# Altium project Motor_Driver.PrjPcb
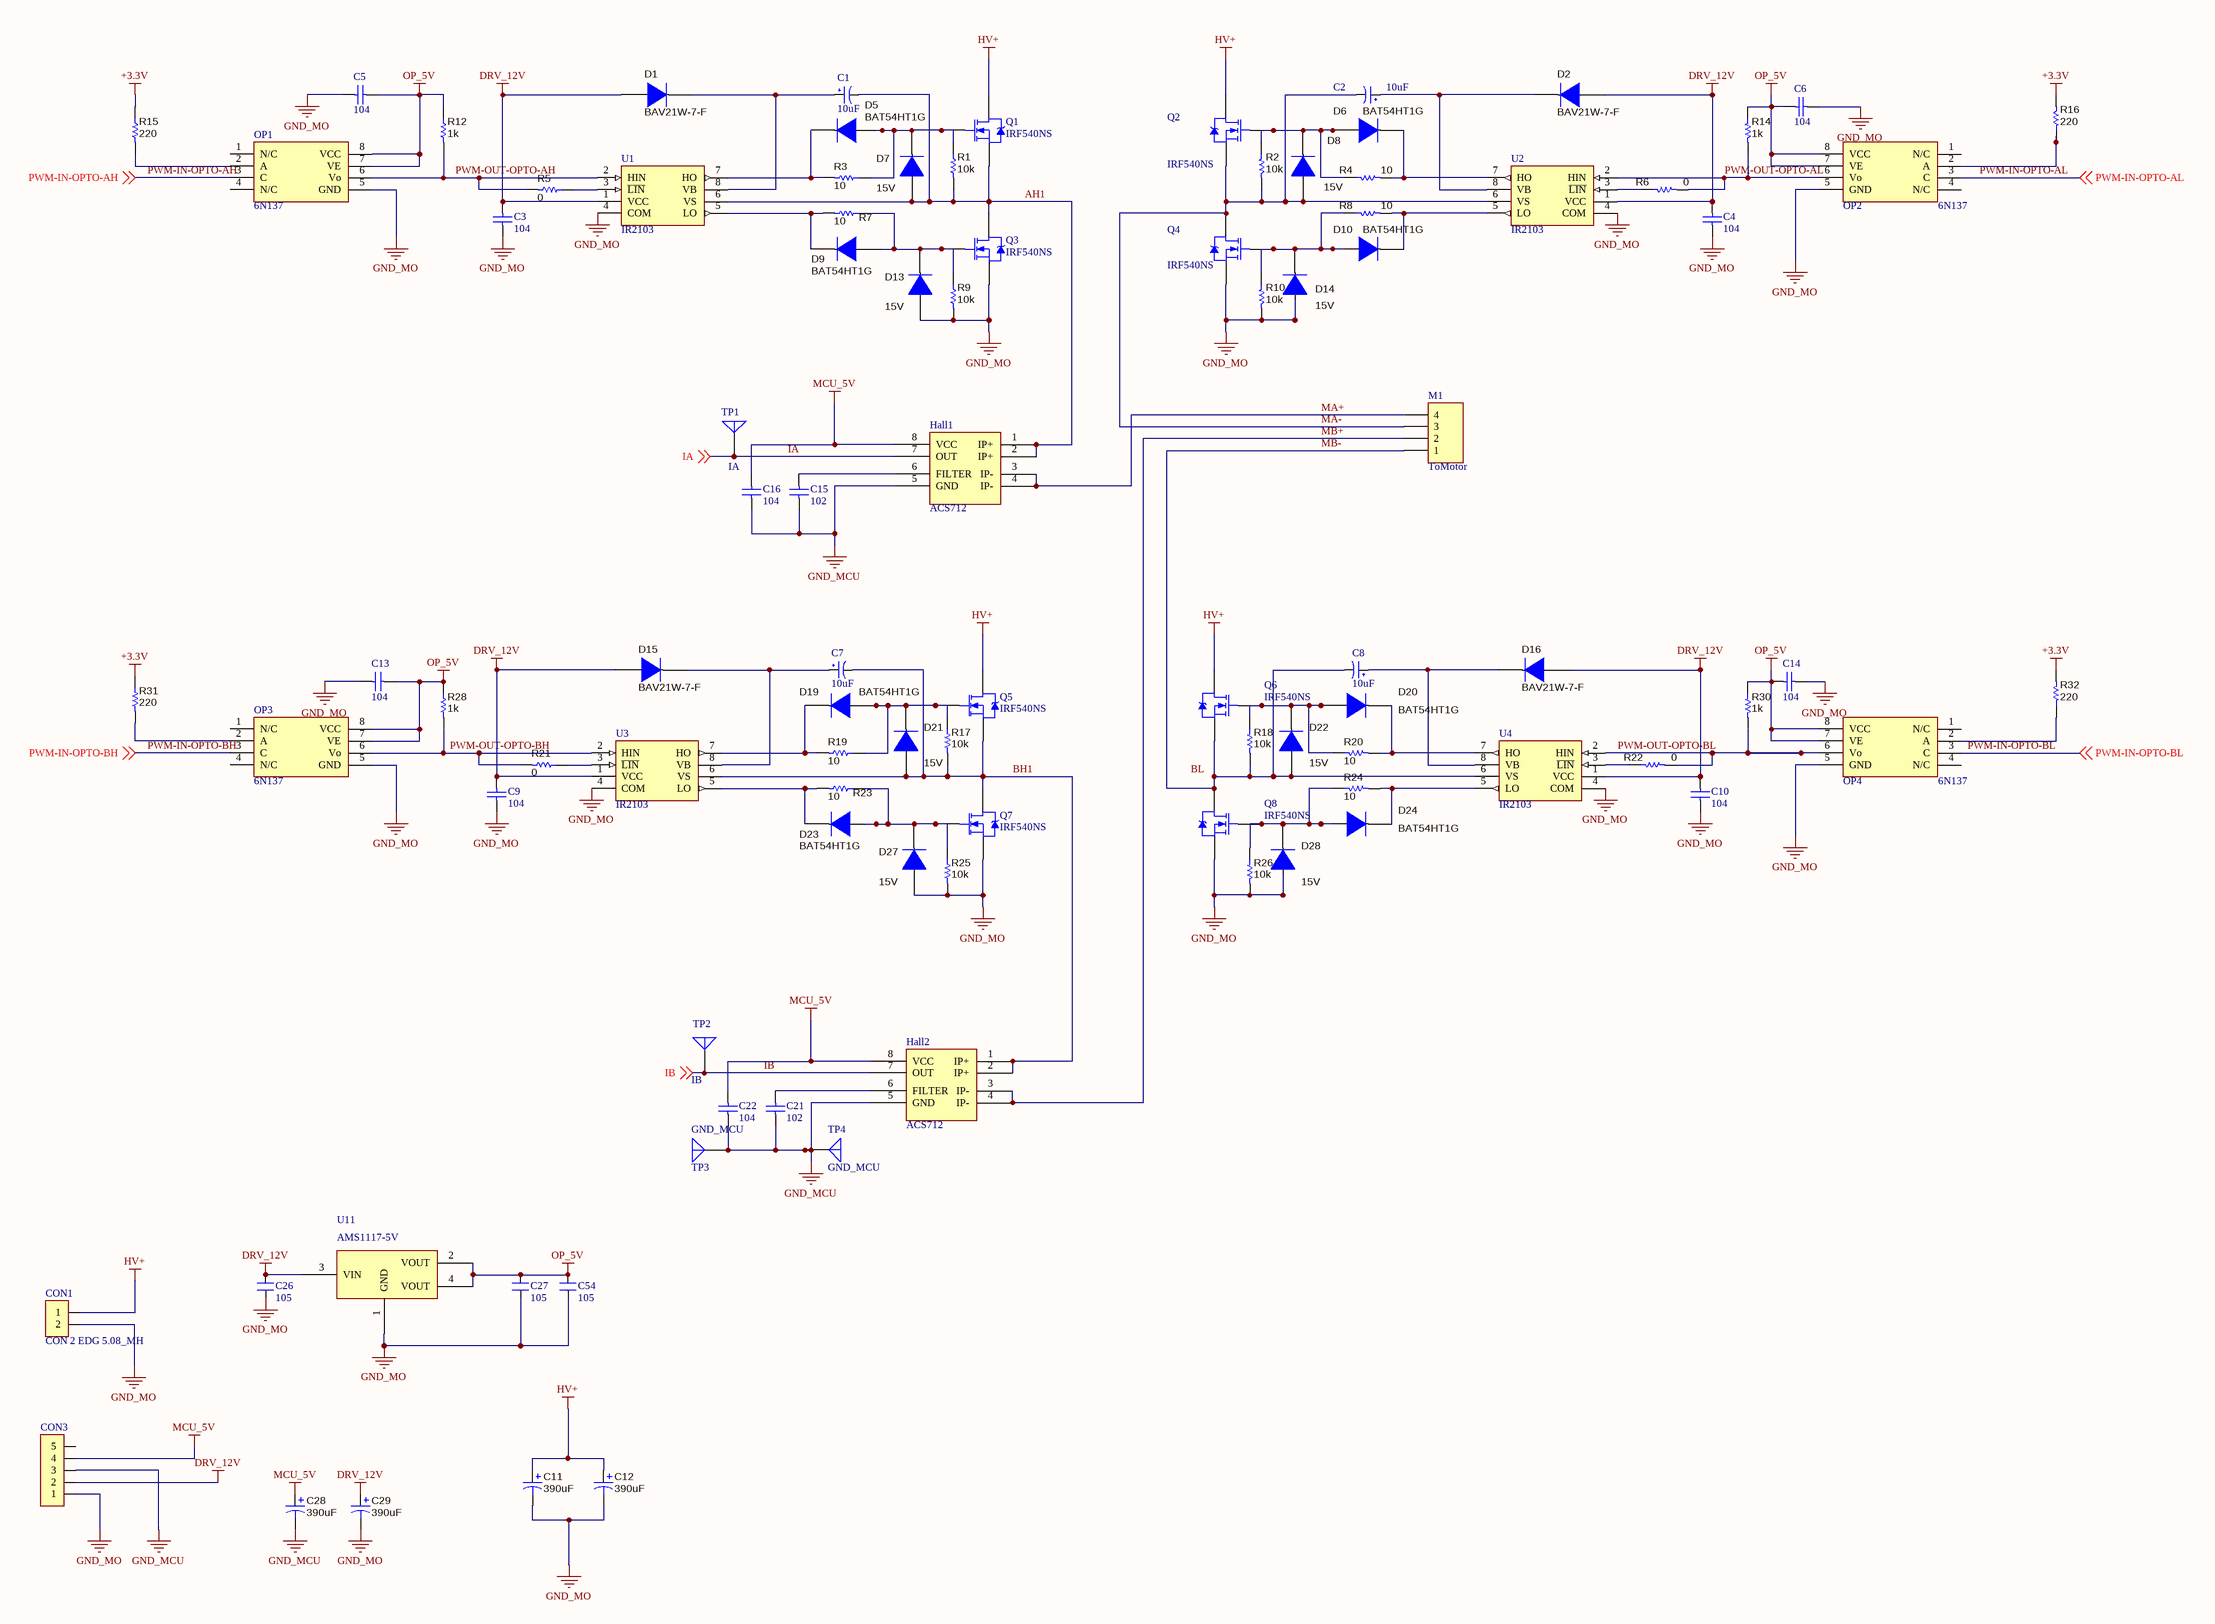
[diagram p0: H_bridge.SchDoc]
2 sheets, 122 parts. Net scope: global (net labels, ports and power ports of the same name join across sheets).
Board file: PCB.PcbDoc
Sheets:
  H_bridge.SchDoc
  MCU.SchDoc

## Sheet H_bridge.SchDoc
size C

### Parts
C1  10uF  [TU_NHOM_10uF_MH]
C2  10uF  [TU_NHOM_10uF_MH]
C3  104  [TU_SMD_0805]
C4  104  [TU_SMD_0805]
C5  104  [TU_SMD_0805]
C6  104  [TU_SMD_0805]
C7  10uF  [TU_NHOM_10uF_MH]
C8  10uF  [TU_NHOM_10uF_MH]
C9  104  [TU_SMD_0805]
C10  104  [TU_SMD_0805]
C11  390uF  [CAP_12.5 X 25]
C12  390uF  [CAP_12.5 X 25]
C13  104  [TU_SMD_0805]
C14  104  [TU_SMD_0805]
C15  102  [TU_SMD_0805]
C16  104  [TU_SMD_0805]
C21  102  [TU_SMD_0805]
C22  104  [TU_SMD_0805]
C26  105  [0805_HV]
C27  105  [0805_HV]
C28  390uF  [CP1/3.0]
C29  390uF  [CP1/3.0]
C54  105  [0805_HV]
CON1  CON 2 EDG 5.08_MH  [CON 2 EDG 5.08]
CON3  CON 5 EDG 5.08_MH  [Con 5 EDG 5.08]  (value not drawn)
D1  BAV21W-7-F  [SOD-323]
D2  BAV21W-7-F  [SOD-323]
D5  BAT54HT1G  [SOD-323]
D6  BAT54HT1G  [SOD-323]
D7  15V  [SOD-323]
D8  15V  [SOD-323]
D9  BAT54HT1G  [SOD-323]
D10  BAT54HT1G  [SOD-323]
D13  15V  [SOD-323]
D14  15V  [SOD-323]
D15  BAV21W-7-F  [SOD-323]
D16  BAV21W-7-F  [SOD-323]
D19  BAT54HT1G  [SOD-323]
D20  BAT54HT1G  [SOD-323]
D21  15V  [SOD-323]
D22  15V  [SOD-323]
D23  BAT54HT1G  [SOD-323]
D24  BAT54HT1G  [SOD-323]
D27  15V  [SOD-323]
D28  15V  [SOD-323]
Hall1  ACS712  [SOP 8]
Hall2  ACS712  [SOP 8]
M1  ToMotor  [Con 4 EDG 5.08]
OP1  6N137 DIP8 Opto 10Mbit  [SMD-8_6.3MM]  (value not drawn)
OP2  6N137 DIP8 Opto 10Mbit  [SMD-8_6.3MM]  (value not drawn)
OP3  6N137 DIP8 Opto 10Mbit  [SMD-8_6.3MM]  (value not drawn)
OP4  6N137 DIP8 Opto 10Mbit  [SMD-8_6.3MM]  (value not drawn)
Q1  IRF540NS  [D2PAK_M_1]
Q2  IRF540NS  [D2PAK_M_1]
Q3  IRF540NS  [D2PAK_M_1]
Q4  IRF540NS  [D2PAK_M_1]
Q5  IRF540NS  [D2PAK_M_1]
Q6  IRF540NS  [D2PAK_M_1]
Q7  IRF540NS  [D2PAK_M_1]
Q8  IRF540NS  [D2PAK_M_1]
R1  10k  [Tro SMD 0805]
R2  10k  [Tro SMD 0805]
R3  10  [Tro SMD 0805]
R4  10  [Tro SMD 0805]
R5  0  [Tro SMD 0805]
R6  0  [Tro SMD 0805]
R7  10  [Tro SMD 0805]
R8  10  [Tro SMD 0805]
R9  10k  [Tro SMD 0805]
R10  10k  [Tro SMD 0805]
R12  1k  [Tro SMD 0805]
R14  1k  [Tro SMD 0805]
R15  220  [Tro SMD 0805]
R16  220  [Tro SMD 0805]
R17  10k  [Tro SMD 0805]
R18  10k  [Tro SMD 0805]
R19  10  [Tro SMD 0805]
R20  10  [Tro SMD 0805]
R21  0  [Tro SMD 0805]
R22  0  [Tro SMD 0805]
R23  10  [Tro SMD 0805]
R24  10  [Tro SMD 0805]
R25  10k  [Tro SMD 0805]
R26  10k  [Tro SMD 0805]
R28  1k  [Tro SMD 0805]
R30  1k  [Tro SMD 0805]
R31  220  [Tro SMD 0805]
R32  220  [Tro SMD 0805]
TP1  IA  [PIN1]
TP2  IB  [PIN1]
TP3  GND_MCU  [PIN1]
TP4  GND_MCU  [PIN1]
U1  IR2103  [SOP 8]
U2  IR2103  [SOP 8]
U3  IR2103  [SOP 8]
U4  IR2103  [SOP 8]
U11  AMS1117-5V  [SOT223]

### Nets
+3.3V: R15.1 R16.2 R31.1 R32.2
DRV_12V: C3.2 C4.2 C9.2 C10.2 C26.2 C29.1(+) CON3.2 D1.2(A) D2.2(A) D15.2(A) D16.2(A) U1.1(VCC) U2.1(VCC) U3.1(VCC) U4.1(VCC) U11.3(VIN)
GND_MCU: C15.1 C16.1 C21.1 C22.1 C28.2(-) CON3.3 Hall1.5(GND) Hall2.5(GND) TP3.1(A) TP4.1(A)
GND_MO: C3.1 C4.1 C5.2 C6.2 C9.1 C10.1 C11.2(-) C12.2(-) C13.2 C14.2 C26.1 C27.1 C29.2(-) C54.1 CON1.2 CON3.1 D13.2(A) D14.2(A) D27.2(A) D28.2(A) OP1.5(GND) OP2.5(GND) OP3.5(GND) OP4.5(GND) Q3.3(S) Q4.3(S) Q7.3(S) Q8.3(S) R9.2 R10.2 R25.2 R26.2 U1.4(COM) U2.4(COM) U3.4(COM) U4.4(COM) U11.1(GND)
HV+: C11.1(+) C12.1(+) CON1.1 Q1.2(D) Q2.2(D) Q5.2(D) Q6.2(D)
MCU_5V: C16.2 C22.2 C28.1(+) CON3.4 Hall1.8(VCC) Hall2.8(VCC)
OP_5V: C5.1 C6.1 C13.1 C14.1 C27.2 C54.2 OP1.7(VE) OP1.8(VCC) OP2.7(VE) OP2.8(VCC) OP3.7(VE) OP3.8(VCC) OP4.7(VE) OP4.8(VCC) R12.1 R14.1 R28.1 R30.1 U11.2(VOUT) U11.4(VOUT)
AH1: C1.2 D7.2(A) Hall1.1(IP+) Hall1.2(IP+) Q1.3(S) Q3.2(D) R1.2 U1.6(VS)
BH1: C7.2 D21.2(A) Hall2.1(IP+) Hall2.2(IP+) Q5.3(S) Q7.2(D) R17.2 U3.6(VS)
IA: Hall1.7(OUT) TP1.1(A) ; off-sheet IA
IB: Hall2.7(OUT) TP2.1(A) ; off-sheet IB
MA+: Hall1.3(IP-) Hall1.4(IP-) M1.4
MA-: C2.2 D8.2(A) M1.3 Q2.3(S) Q4.2(D) R2.2 U2.6(VS)
MB+: Hall2.3(IP-) Hall2.4(IP-) M1.2
MB-: C8.2 D22.2(A) M1.1 Q6.3(S) Q8.2(D) R18.2 U4.6(VS)
PWM-IN-OPTO-AH: OP1.3(C) ; off-sheet PWM-IN-OPTO-AH
PWM-IN-OPTO-AL: OP2.3(C) ; off-sheet PWM-IN-OPTO-AL
PWM-IN-OPTO-BH: OP3.3(C) ; off-sheet PWM-IN-OPTO-BH
PWM-IN-OPTO-BL: OP4.3(C) ; off-sheet PWM-IN-OPTO-BL
PWM-OUT-OPTO-AH: OP1.6(Vo) R5.2 R12.2 U1.2(HIN)
PWM-OUT-OPTO-AL: OP2.6(Vo) R6.2 R14.2 U2.2(HIN)
PWM-OUT-OPTO-BH: OP3.6(Vo) R21.2 R28.2 U3.2(HIN)
PWM-OUT-OPTO-BL: OP4.6(Vo) R22.2 R30.2 U4.2(HIN)
NetC1_1: C1.1 D1.1(K) U1.8(VB)
NetC2_1: C2.1 D2.1(K) U2.8(VB)
NetC7_1: C7.1 D15.1(K) U3.8(VB)
NetC8_1: C8.1 D16.1(K) U4.8(VB)
NetC15_2: C15.2 Hall1.6(FILTER)
NetC21_2: C21.2 Hall2.6(FILTER)
NetD5_1: D5.1(K) R3.2 U1.7(HO)
NetD5_2: D5.2(A) D7.1(K) Q1.1(G) R1.1 R3.1
NetD6_1: D6.1(K) R4.2 U2.7(HO)
NetD6_2: D6.2(A) D8.1(K) Q2.1(G) R2.1 R4.1
NetD9_1: D9.1(K) R7.2 U1.5(LO)
NetD9_2: D9.2(A) D13.1(K) Q3.1(G) R7.1 R9.1
NetD10_1: D10.1(K) R8.2 U2.5(LO)
NetD10_2: D10.2(A) D14.1(K) Q4.1(G) R8.1 R10.1
NetD19_1: D19.1(K) R19.2 U3.7(HO)
NetD19_2: D19.2(A) D21.1(K) Q5.1(G) R17.1 R19.1
NetD20_1: D20.1(K) R20.2 U4.7(HO)
NetD20_2: D20.2(A) D22.1(K) Q6.1(G) R18.1 R20.1
NetD23_1: D23.1(K) R23.2 U3.5(LO)
NetD23_2: D23.2(A) D27.1(K) Q7.1(G) R23.1 R25.1
NetD24_1: D24.1(K) R24.2 U4.5(LO)
NetD24_2: D24.2(A) D28.1(K) Q8.1(G) R24.1 R26.1
NetOP1_2: OP1.2(A) R15.2
NetOP2_2: OP2.2(A) R16.1
NetOP3_2: OP3.2(A) R31.2
NetOP4_2: OP4.2(A) R32.1
NetR5_1: R5.1 U1.3(~{LIN})
NetR6_1: R6.1 U2.3(~{LIN})
NetR21_1: R21.1 U3.3(~{LIN})
NetR22_1: R22.1 U4.3(~{LIN})

Not connected (* = marked no-connect by the designer): CON3 5; OP1 1(N/C) 4(N/C); OP2 1(N/C) 4(N/C); OP3 1(N/C) 4(N/C); OP4 1(N/C) 4(N/C)

### Notes on the sheet
- Labels drawn without touching a wire or pin: BL

### Library data of the parts
C1 C2 C7 C8 = TU_NHOM_10uF_25V_MH: Value: 47uF/16 - 50V; Description 1: 470uF/6,3V - 330uF/10V - 220uF/16V; Description 2: 100uF/25V - 35V - 47uF/50V - 22uF/100V; Description 3: 33uF => 47uF/63V - 1uF => 4,7uF/160V; Description 4: 1uF => 2,2uF/250V - 1uF/350V
C3-C6 C9 C10 C13-C16 C21 C22 = Capacitor 0805: Ceramic Chip Capacitor - Standard; Note: Footprint corresponds to dimensions for bulk cassette packaging. This case size has tightened tolerances.; Published: 17-Jul-2002; LatestRevisionDate: 19-Mar-2004; LatestRevisionNote: Silkscreen size reduced.; DatasheetDocument: Mar-2001; PackageDocument: Mar-2001; PackageReference: 0805; Publisher: Altium Limited; Code_JEITA: 0805; Code_IPC: 2012[0805]; ComponentLink1Description: Manufacturer Link; ComponentLink1URL: http://www.kemet.com/; ComponentLink2Description: Datasheet; ComponentLink2URL: http://www.kemet.com/kemet/web/homepage/kechome.nsf/vapubfilesname/F3102TA.pdf/$file/F3102TA.pdf
  C3-C6 C9 C10 C13 C14 C16 C22: Value: 104
  C15 C21: Value: 102
C11 C12 = Capacitor TuHoa: CAP ALUM 390UF 20% 50V RADIAL; PartNumber: UHW1H391MPD6; Manufacturer: Nichicon; Polarized: Y; U/M: EA; Cap_F: 0.000390; Tolerance_%: 20; Value1: Unknown; VDC_V: 50; TaMin_C: -40; TaMax_C: 105; Cap_Case: 10x22; AEC Category: Q200; AEC Qualified: N; CompType: Capacitor; SymbolVersion: 2008-07-09; Value: 390uF; PackageReference: 10x22; RoHS: Y; Value2: 50V; MountType: TH; Technology: AL; Series: ZL; Publisher: Texas Instruments; LatestRevisionDate: 2015-12-17; ComponentLink1Description: Datasheet link; ComponentLink1URL: http://nichicon-us.com/english/products/pdfs/e-uhw.pdf; Supplier 1: Digi-Key; Supplier Part Number 1: 493-6885-ND; AEC Grade: N/A; ValueDisplayed: 390uF
C26 C27 C54 = CM: Cap SMD; Value: 103
C28 C29 = Capacitor TuHoa: PartNumber: UHW1H391MPD6; Manufacturer: Nichicon; Polarized: Y; U/M: EA; Cap_F: 0.000390; Tolerance_%: 20; Value1: Unknown; VDC_V: 50; Value2: 50V; TaMin_C: -40; TaMax_C: 105; Cap_Case: 10x22; AEC Category: Q200; AEC Qualified: N; CompType: Capacitor; SymbolVersion: 2008-07-09; Value: 390uF; PackageReference: 10x22; RoHS: Y; MountType: TH; Technology: AL; Series: ZL; Publisher: Texas Instruments; LatestRevisionDate: 2015-12-17; ComponentLink1Description: Datasheet link; ComponentLink1URL: http://nichicon-us.com/english/products/pdfs/e-uhw.pdf; Supplier 1: Digi-Key; Supplier Part Number 1: 493-6885-ND; AEC Grade: N/A; ValueDisplayed: 390uF
CON1 = CON 2 EDG 5.08_MH: CON 2 EDG 5.08 (xanh cong)
CON3 = CON 5 EDG 5.08_MH: CON 5 EDG 5.08 (xanh cong)
D1 D2 D5 D6 D9 D10 D15 D16 D19 D20 D23 D24 = MMDL914-TP: Diode, Switching, 100 V, 0.2 A, SOD-323; Manufacturer: Micro Commercial Components; U/M: EA; Vf_V: 1; Value: 100V; Value1: 0.2A; Value2: 1V; Io_A: 0.2; Vr_V: 100; TJmax_C: 150; SizeAreaWB_mm2: 8.695; SizeArea_mm2: 3.645; SizeX_mm: 2.7; SizeY_mm: 1.35; AEC Category: Q101; SymbolVersion: 2008-12-08; PackageReference: SOD-323; CompType: Diode; MountType: SMT; Type: Switching; RoHS: Y; SizeZ_mm: 1; Published: 2008-06-26; Publisher: Texas Instruments; LatestRevisionDate: 2016-10-18; ComponentLink1Description: Datasheet link; ComponentLink1URL: http://www.mccsemi.com/up_pdf/MMDL914(SOD-323).pdf; Supplier 1: Digi-Key; Supplier Part Number 1: MMDL914-TPMSCT-ND; AEC Qualified: ?
  D1 D2 D15 D16: PartNumber: BAV21W-7-F
  D5 D6 D9 D10 D19 D20 D23 D24: PartNumber: BAT54HT1G
D7 D8 D13 D14 D21 D22 D27 D28 = MMDL914-TP: Diode, Switching, 100 V, 0.2 A, SOD-323; PartNumber: BAV21W-7-F; Manufacturer: Micro Commercial Components; U/M: EA; Vf_V: 1; Value: 100V; Value1: 0.2A; Value2: 1V; Io_A: 0.2; Vr_V: 100; TJmax_C: 150; SizeAreaWB_mm2: 8.695; SizeArea_mm2: 3.645; SizeX_mm: 2.7; SizeY_mm: 1.35; AEC Category: Q101; SymbolVersion: 2008-12-08; PackageReference: SOD-323; CompType: Diode; MountType: SMT; Type: Switching; RoHS: Y; SizeZ_mm: 1; Published: 2008-06-26; Publisher: Texas Instruments; LatestRevisionDate: 2016-10-18; ComponentLink1Description: Datasheet link; ComponentLink1URL: http://www.mccsemi.com/up_pdf/MMDL914(SOD-323).pdf; Supplier 1: Digi-Key; Supplier Part Number 1: MMDL914-TPMSCT-ND; AEC Qualified: ?
M1 = Header 4: Header, 4-Pin; LatestRevisionDate: 17-Jul-2002; LatestRevisionNote: Re-released for DXP Platform.; Publisher: Altium Limited
OP1-OP4 = 6N137: 6N137 DIP8 Opto 10Mbit/s
Q1-Q8 = IRF540NS: HEXFET Power MOSFET; Published: 8-Jun-2000; LatestRevisionDate: 20-Nov-2009; LatestRevisionNote: IPC-7351 Footprint Added.; DatasheetVersion: May-1998; PackageReference: D2PAK; Publisher: Altium Limited; PackageDescription: 3-Pin Transistor Outline Package 2.54 mm Pitch, 15.1 mm Lead Span; ComponentLink1Description: Manufacturer Link; ComponentLink1URL: http://www.irf.com/; ComponentLink2Description: Datasheet; ComponentLink2URL: http://www.irf.com/product-info/datasheets/data/irf540ns.pdf; Supplier 1: Farnell
R1-R10 R12 R14-R26 R28 R30-R32 = R nho: RES, 100, 1%, 0.1 W, 0402; PartNumber: ERJ-2RKF1000X; Manufacturer: Panasonic; CompType: Resistor; Res_ohm: 100; Value_Code: 100R; Tolerance_%: 1; Power_W: 0.1; Value2: 0.1W; VDC_V: 50; TempCo: 100 ppm/C; EIA_Code: E96; U/M: EA; AEC Category: Q200; SymbolVersion: 2009-05-29; PackageReference: 0402; RoHS: Y; Value1: 1%; MountType: SMT; Technology: Thick Film; Published: 2008-06-26; Publisher: Texas Instruments; LatestRevisionDate: 2016-01-08; ComponentLink1Description: Datasheet link; ComponentLink1URL: http://industrial.panasonic.com/www-data/pdf/AOA0000/AOA0000CE2.pdf; Supplier 1: Digi-Key; Supplier Part Number 1: P100LCT-ND; Supplier 2: Mouser; Supplier Part Number 2: 667-ERJ-2RKF1000X; Supplier 3: Farnell; Supplier Part Number 3: 2304034; AEC Qualified: ?
  R1 R2 R9 R10 R17 R18 R25 R26: Value: 10k
  R3 R4 R7 R8 R19 R20 R23 R24: Value: 10
  R5 R6 R21 R22: Value: 0
  R12 R14 R28 R30: Value: 1k
  R15 R16 R31 R32: Value: 220
TP1-TP4 = Antenna: Generic Antenna; Published: 24-Mar-1999; LatestRevisionDate: 17-Jul-2002; LatestRevisionNote: Re-released for DXP Platform.; PackageReference: PIN1; Publisher: Altium Limited
U1-U4 = IR2103: High and Low Side Driver; Published: 8-Jun-2000; LatestRevisionDate: 04-Mar-2005; LatestRevisionNote: Stylized 3D Model Added.; DatasheetVersion: PD600451; PackageReference: PDIP8; Publisher: Altium Limited; PackageDescription: DIP; 8 Leads; Row Spacing 7.62 mm; Pitch 2.54 mm; Code_JEDEC: MO-001-AN; ComponentLink1Description: Manufacturer Link; ComponentLink1URL: http://www.irf.com/; ComponentLink2Description: Datasheet; ComponentLink2URL: http://www.irf.com/product-info/datasheets/data/ir2103.pdf
U11 = AMS1117-3.3V SOT223 _MH

## Sheet MCU.SchDoc
size B
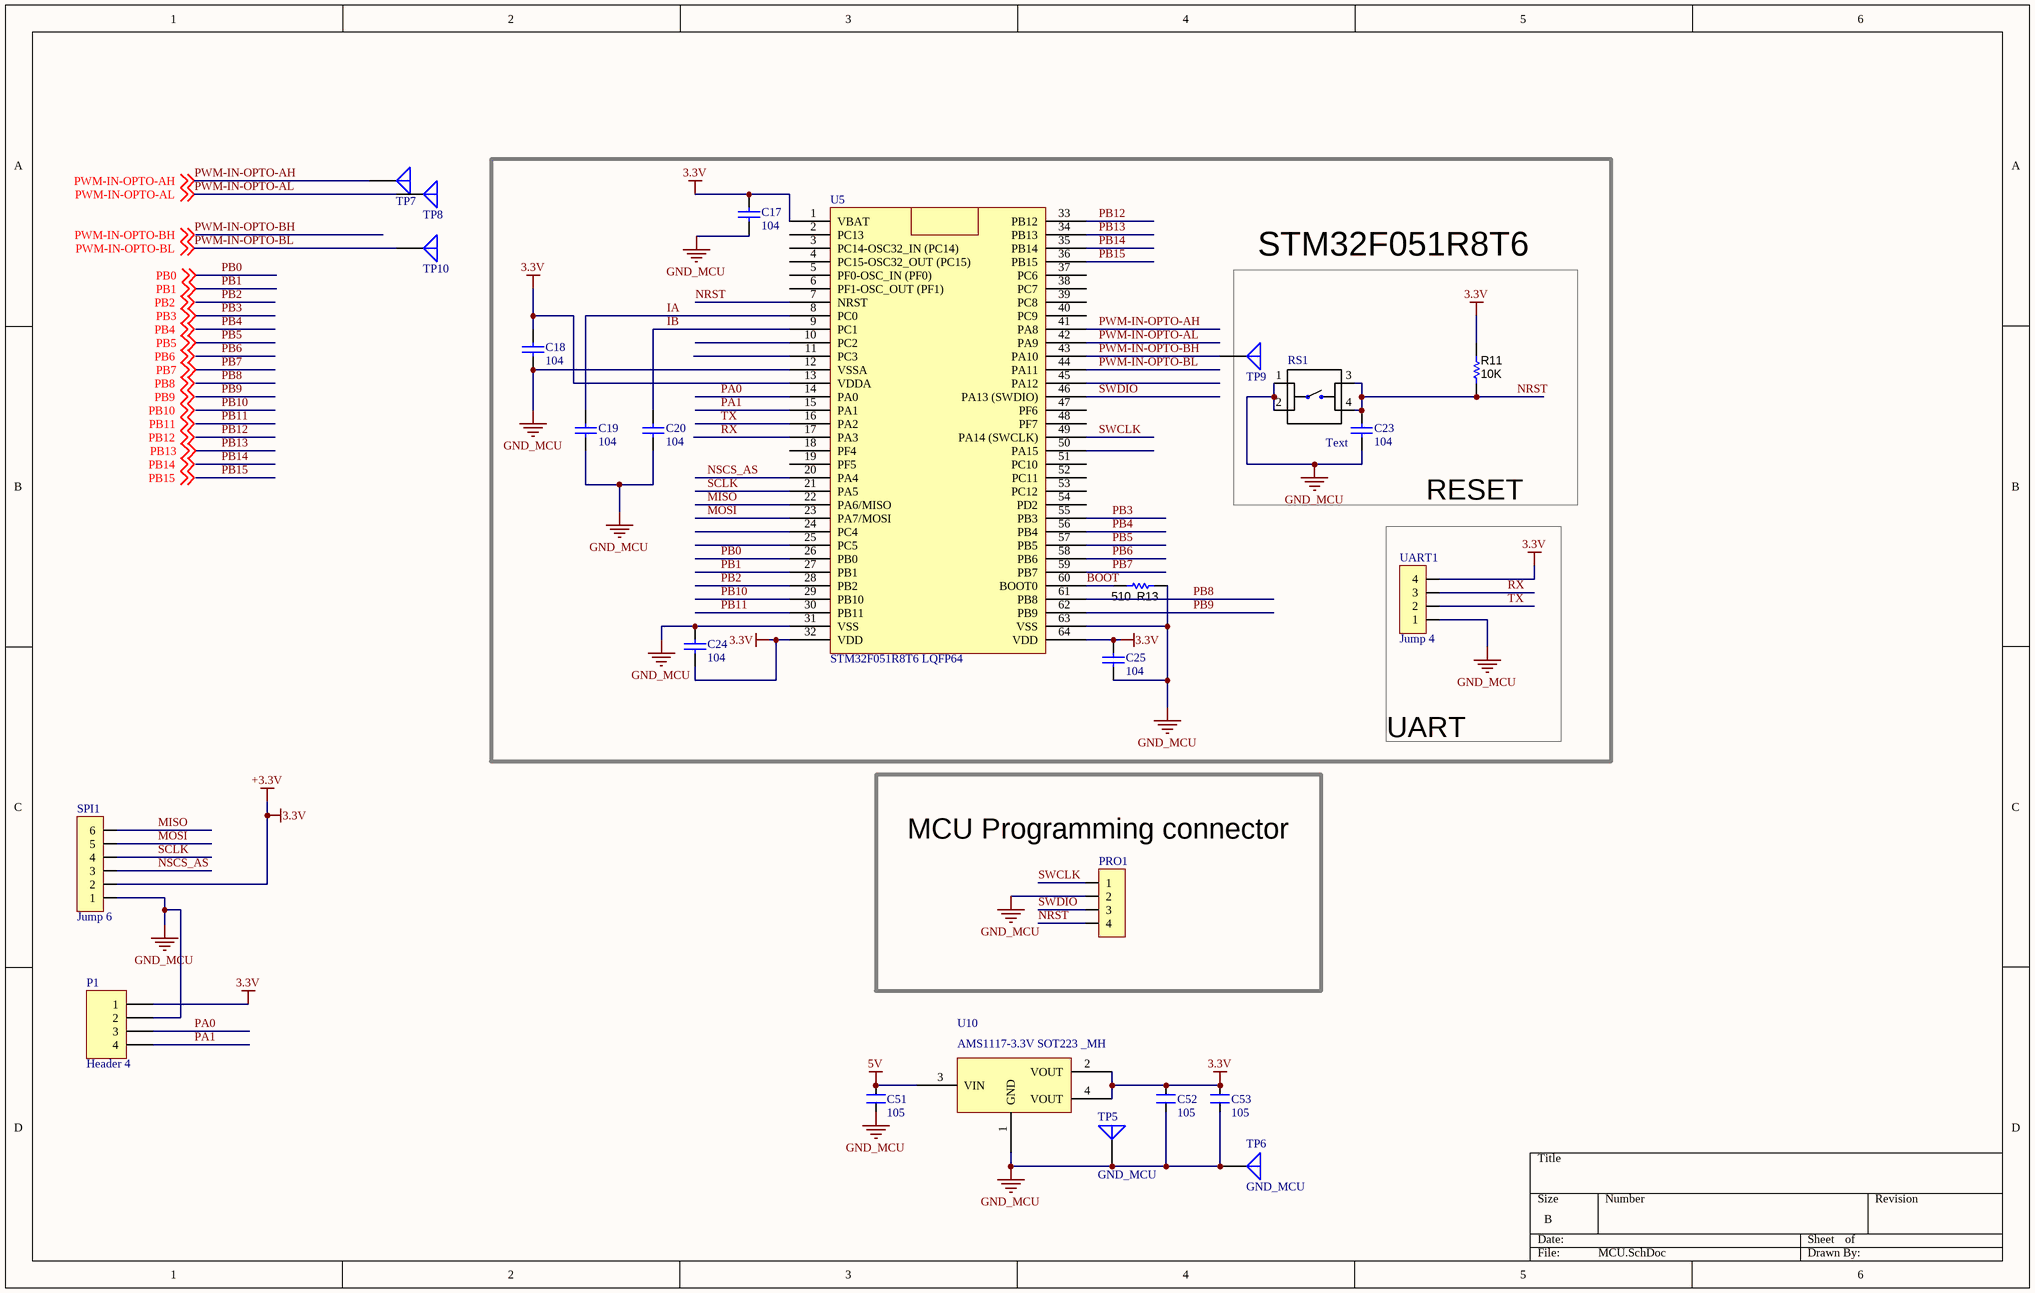
[diagram p1: MCU.SchDoc]

### Parts
C17  104  [0603_Cap]
C18  104  [0805_hv]
C19  104  [TU_SMD_0805]
C20  104  [TU_SMD_0805]
C23  104  [0603_Cap]
C24  104  [0805_hv]
C25  104  [0805_hv]
C51  105  [0805_HV]
C52  105  [0805_HV]
C53  105  [0805_HV]
P1  Header 4  [HDR1X4]
PRO1  Jump 4_MH  [Jump 4]  (value not drawn)
R11  10K  [0603_R]
R13  510  [0603_R]
RS1  *  [SMD Button 6X6]  (value not drawn)
SPI1  Jump 6  [ZH 1.5 6P]
TP5  GND_MCU  [PIN1]
TP6  GND_MCU  [PIN1]
TP7  PW1  [PIN1]  (value not drawn)
TP8  PW1  [PIN1]  (value not drawn)
TP9  PW  [PIN1]  (value not drawn)
TP10  PW1  [PIN1]  (value not drawn)
U5  STM32F051R8T6 LQFP64  [LQFP64]
U10  AMS1117-3.3V SOT223 _MH  [SOT223]
UART1  Jump 4  [HEADER 4]

### Blocks framed on the sheet
STM32F051R8T6: C17-C20 C24 C25 R13 U5
RESET: C23 R11 RS1 TP9
UART: UART1
MCU Programming connector: PRO1

### Nets
5V: C51.2 U10.3(VIN)
+3.3V: C17.2 C18.2 C24.1 C25.2 C52.2 C53.2 P1.1 R11.2 SPI1.2 U5.1(VBAT) U5.13(VDDA) U5.32(VDD) U5.64(VDD) U10.2(VOUT) U10.4(VOUT) UART1.4  [also labelled 3.3V]
GND_MCU: C17.1 C18.1 C19.1 C20.1 C23.1 C24.2 C25.1 C51.1 C52.1 C53.1 P1.2 PRO1.2 R13.1 RS1.1 RS1.2 SPI1.1 TP5.1(A) TP6.1(A) U5.12(VSSA) U5.31(VSS) U5.63(VSS) U10.1(GND) UART1.1
BOOT: R13.2 U5.60(BOOT0)
IA: C19.2 U5.8(PC0)
IB: C20.2 U5.9(PC1)
MISO: SPI1.6 U5.22(PA6/MISO)
MOSI: SPI1.5 U5.23(PA7/MOSI)
NRST: C23.2 PRO1.4 R11.1 RS1.3 RS1.4 U5.7(NRST)
NSCS_AS: SPI1.3 U5.20(PA4)
PA0: P1.3 U5.14(PA0)
PA1: P1.4 U5.15(PA1)
PB0: U5.26(PB0) ; off-sheet PB0
PB1: U5.27(PB1) ; off-sheet PB1
PB2: U5.28(PB2) ; off-sheet PB2
PB3: U5.55(PB3) ; off-sheet PB3
PB4: U5.56(PB4) ; off-sheet PB4
PB5: U5.57(PB5) ; off-sheet PB5
PB6: U5.58(PB6) ; off-sheet PB6
PB7: U5.59(PB7) ; off-sheet PB7
PB8: U5.61(PB8) ; off-sheet PB8
PB9: U5.62(PB9) ; off-sheet PB9
PB10: U5.29(PB10) ; off-sheet PB10
PB11: U5.30(PB11) ; off-sheet PB11
PB12: U5.33(PB12) ; off-sheet PB12
PB13: U5.34(PB13) ; off-sheet PB13
PB14: U5.35(PB14) ; off-sheet PB14
PB15: U5.36(PB15) ; off-sheet PB15
PWM-IN-OPTO-AH: TP7.1(A) U5.41(PA8) ; off-sheet PWM-IN-OPTO-AH
PWM-IN-OPTO-AL: TP8.1(A) U5.42(PA9) ; off-sheet PWM-IN-OPTO-AL
PWM-IN-OPTO-BH: TP9.1(A) U5.43(PA10) ; off-sheet PWM-IN-OPTO-BH
PWM-IN-OPTO-BL: TP10.1(A) U5.44(PA11) ; off-sheet PWM-IN-OPTO-BL
RX: U5.17(PA3) UART1.3
SCLK: SPI1.4 U5.21(PA5)
SWCLK: PRO1.1 U5.49(PA14_(SWCLK))
SWDIO: PRO1.3 U5.46(PA13_(SWDIO))
TX: U5.16(PA2) UART1.2

Not connected (* = marked no-connect by the designer): U5 2(PC13) 3(PC14-OSC32_IN_(PC14)) 4(PC15-OSC32_OUT_(PC15)) 5(PF0-OSC_IN_(PF0)) 6(PF1-OSC_OUT_(PF1)) 10(PC2) 11(PC3) 18(PF4) 19(PF5) 24(PC4) 25(PC5) 37(PC6) 38(PC7) 39(PC8) 40(PC9) 45(PA12) 47(PF6) 48(PF7) 50(PA15) 51(PC10) 52(PC11) 53(PC12) 54(PD2)

### Notes on the sheet
- (near C23) Text
- Labels drawn without touching a wire or pin: PB2, PB4, PB6, PB8, PB9, PB10, PB11, PB12, PB14, PB15

### Library data of the parts
C17-C20 C23-C25 = Capacitor 0805: as C3 on sheet H_bridge; Published: 17-Jul-2002; LatestRevisionDate: 19-Mar-2004; LatestRevisionNote: Silkscreen size reduced.; DatasheetDocument: Mar-2001; PackageDocument: Mar-2001; PackageReference: 0805; Publisher: Altium Limited; Code_JEITA: 0805; Code_IPC: 2012[0805]; ComponentLink1Description: Manufacturer Link; ComponentLink1URL: http://www.kemet.com/; ComponentLink2Description: Datasheet; ComponentLink2URL: http://www.kemet.com/kemet/web/homepage/kechome.nsf/vapubfilesname/F3102TA.pdf/$file/F3102TA.pdf; Value: 104
C51-C53 = CM: Cap SMD; Value: 103
P1 = Header 4: Header, 4-Pin; LatestRevisionDate: 17-Jul-2002; LatestRevisionNote: Re-released for DXP Platform.; Publisher: Altium Limited
PRO1 = Jump 4_MH: Jump 4P 2.54
R11 R13 = R nho: as R1 on sheet H_bridge; SymbolVersion: 2009-05-29; PackageReference: 0402; RoHS: Y; Value1: 1%; MountType: SMT; Technology: Thick Film; Published: 2008-06-26; Publisher: Texas Instruments; LatestRevisionDate: 2016-01-08; ComponentLink1Description: Datasheet link; ComponentLink1URL: http://industrial.panasonic.com/www-data/pdf/AOA0000/AOA0000CE2.pdf; Supplier 1: Digi-Key; Supplier Part Number 1: P100LCT-ND; Supplier 2: Mouser; Supplier Part Number 2: 667-ERJ-2RKF1000X; Supplier 3: Farnell; Supplier Part Number 3: 2304034; AEC Qualified: ?
  R11: Value: 10K
  R13: Value: 510
RS1 = SMD Button 6X6: FSM4JSMA=SMT,TACTILE,PB SWITCH; Configuration_Pole-Throw: Single Pole - Single Throw; MP: 4-1437565-1; MF: TE Connectivity; Contact_Current_Rating: 50 mA; Availability: Good; Price: 0.15 USD; Package: None; Link: http://www.te.com/usa-en/product-4-1437565-1.html; EU_RoHS_Compliance: Compliant; SnapEDA_Link: https://www.snapeda.com/parts/4-1437565-1/TE%20Connectivity/view-part/?ref=snap; Value: *; Supplier 1: Digi-Key; Supplier Part Number 1: 450-1759-2-ND
SPI1 = Jump 6: Jump 6P 2.54
TP5-TP10 = Antenna: Generic Antenna; Published: 24-Mar-1999; LatestRevisionDate: 17-Jul-2002; LatestRevisionNote: Re-released for DXP Platform.; PackageReference: PIN1; Publisher: Altium Limited
U5 = STM32F051R8T6 LQFP64 _MH
UART1 = Jump 4: Jump 4P 2.54

## Nets that join several sheets
+3.3V: H_bridge (R15.1 R16.2 R31.1 R32.2), MCU (16 pins)
GND_MCU: H_bridge (10 pins), MCU (23 pins)
IA: H_bridge (Hall1.7 TP1.1), MCU (C19.2 U5.8)
IB: H_bridge (Hall2.7 TP2.1), MCU (C20.2 U5.9)
PWM-IN-OPTO-AH: H_bridge (OP1.3), MCU (TP7.1 U5.41)
PWM-IN-OPTO-AL: H_bridge (OP2.3), MCU (TP8.1 U5.42)
PWM-IN-OPTO-BH: H_bridge (OP3.3), MCU (TP9.1 U5.43)
PWM-IN-OPTO-BL: H_bridge (OP4.3), MCU (TP10.1 U5.44)